# Altium schematic sheet H.SchDoc
size A4
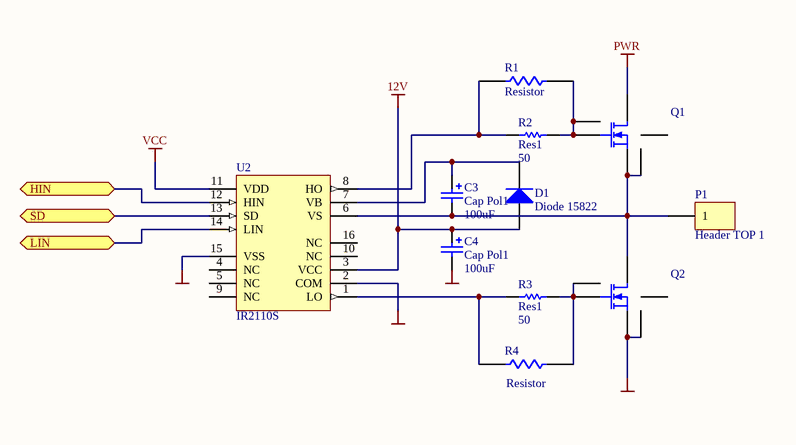
[diagram p0: H.SchDoc]

## Parts
C3  Cap Pol1  value 100uF  [CAPR-Small]
C4  Cap Pol1  value 100uF  [CAPR-Small]
D1  Diode 15822  [DO-35]
P1  Header TOP 1  [PIN1]
Q1  NMOSFET-UNIVERSAL  [NMOSFET-UNIVERSAL]  (value not drawn)
Q2  NMOSFET-UNIVERSAL  [NMOSFET-UNIVERSAL]  (value not drawn)
R1  Resistor  [6-0805_M]
R2  Res1  value 50  [AXIAL-0.3]
R3  Res1  value 50  [AXIAL-0.3]
R4  Resistor  [6-0805_M]
U2  IR2110S  [SOIC16_N]

## Ports
HIN, LIN, SD

## Nets
12V: C4.1 D1.1(A) U2.3(VCC)
GND: C4.2 Q2.3(S) Q2.5 U2.2(COM) U2.15(VSS)
PWR: Q1.2(D)
VCC: U2.11(VDD)
HIN: U2.12(HIN) ; port HIN
LIN: U2.14(LIN) ; port LIN
SD: U2.13(SD) ; port SD
NetC3_1: C3.1 D1.2(K) U2.7(VB)
NetC3_2: C3.2 P1.1 Q1.3(S) Q1.5 Q2.2(D) U2.6(VS)
NetQ1_1: Q1.1(G) Q1.4 R1.1 R2.2
NetQ2_1: Q2.1(G) Q2.4 R3.2 R4.1
NetR1_2: R1.2 R2.1 U2.8(HO)
NetR3_1: R3.1 R4.2 U2.1(LO)

Not connected (* = marked no-connect by the designer): Q1 6; Q2 6; U2 4(NC) 5(NC) 9(NC) 10(NC) 16(NC)

## Library data of the parts
C3 C4 = Cap Pol1: Polarized Capacitor (Radial); Published: 8-Jun-2000; LatestRevisionDate: 17-Jul-2002; LatestRevisionNote: Re-released for DXP Platform.; PackageReference: RB7.6-15; Publisher: Altium Limited; PackageDescription: Polarized Capacitor (Radial); 2 Leads
D1 = Diode 1N4448: High Conductance Fast Diode; Published: 8-Jun-2000; LatestRevisionDate: 17-Jul-2002; LatestRevisionNote: Re-released for DXP Platform.; DatasheetVersion: 1997; PackageReference: DO-35; Publisher: Altium Limited; PackageDescription: Diode, Axial; Body 3.8 x 1.9 mm (LxDia. max), Lead Dia. 0.53 mm (max); Code_JEDEC: DO-204-AH; ComponentLink1Description: Manufacturer Link; ComponentLink1URL: http://www.fairchildsemi.com/; ComponentLink2Description: Datasheet; ComponentLink2URL: http://www.fairchildsemi.com/ds/1N%2F1N4448.pdf
P1 = Header TOP 1: Header, 1Pin; LatestRevisionDate: 17-Jul-2002; LatestRevisionNote: Re-released for DXP Platform.; Publisher: Altium Limited
Q1 Q2 = NMOSFET-UNIVERSAL: N-Channel MOSFET; Published: 8-Jun-2000; LatestRevisionDate: 17-Jul-2002; LatestRevisionNote: Re-released for DXP Platform.; PackageVersion: 1995/1996; PackageReference: E3; Publisher: Altium Limited; PackageDescription: TO, Flat Index; 3 In-Line, Axial Leads; Body Dia. 4.6mm; Lead Dia. 0.5 mm (max)
R2 R3 = Res1: Resistor; Published: 8-Jun-2000; LatestRevisionDate: 17-Jul-2002; LatestRevisionNote: Re-released for DXP Platform.; PackageReference: AXIAL-0.3; Publisher: Altium Limited; PackageDescription: Axial Device, Thru-Hole; 2 Leads; 0.3 in Pin Spacing
U2 = IR2110S: High and Low Side Driver; Note: Pins 4, 5, 9, 10 and 16 are not connected; Published: 8-Jun-2000; LatestRevisionDate: 13-Apr-2006; LatestRevisionNote: IPC-7351 Footprint Added.; DatasheetVersion: PD60147J; PackageReference: SOIC16; Publisher: Altium Limited; PackageDescription: 16-Pin Small Outline Integrated Circuit 1.27 mm Pitch; Code_JEDEC: MS-013-AA; Code_IPC: SOIC127P1030-16; ComponentLink1Description: Manufacturer Link; ComponentLink1URL: http://www.irf.com/; ComponentLink2Description: Datasheet; ComponentLink2URL: http://www.irf.com/product-info/datasheets/data/ir2110.pdf
R1 R4 = Resistor: Published: 24-Mar-1999; LatestRevisionDate: 29-May-2009; LatestRevisionNote: IPC-7351 Footprint Added.; PackageVersion: Mar-2003; PackageReference: 6-0805; Publisher: Altium Limited; PackageDescription: Chip Resistor 0805 Case Size; Code_IPC: RESC2012